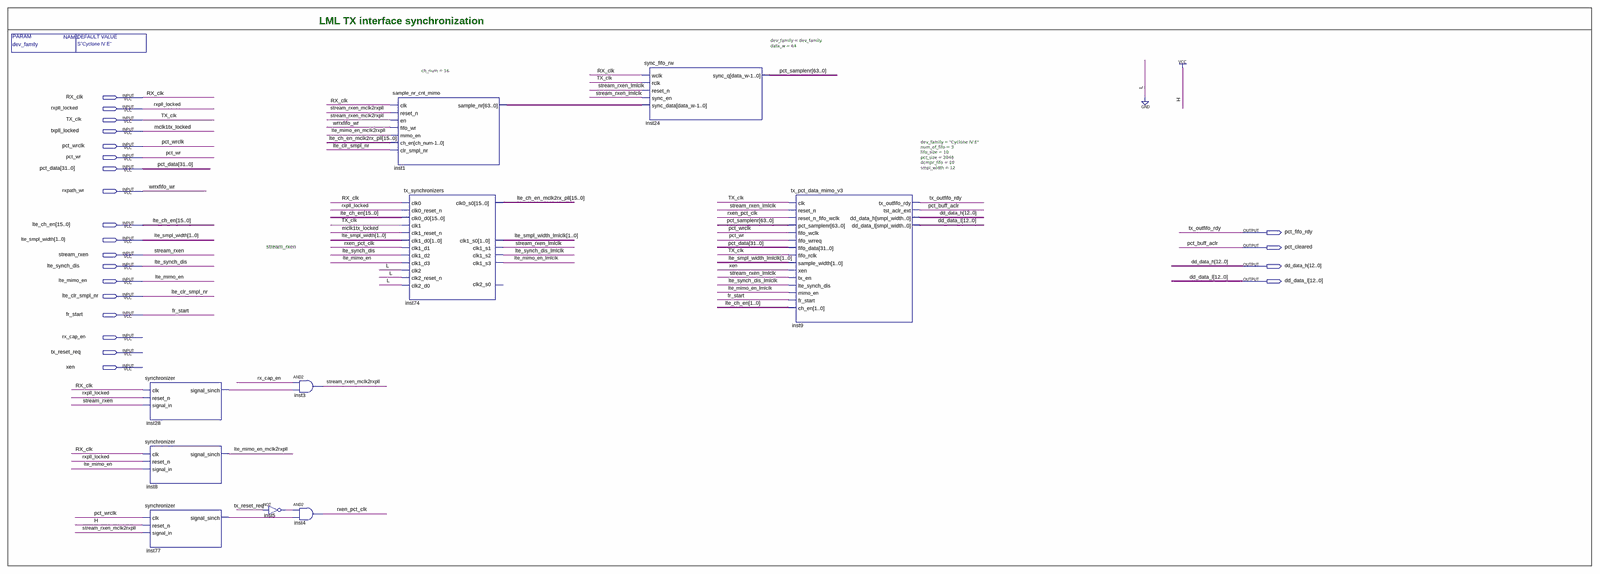
[diagram p0: schematic sheet, whole]
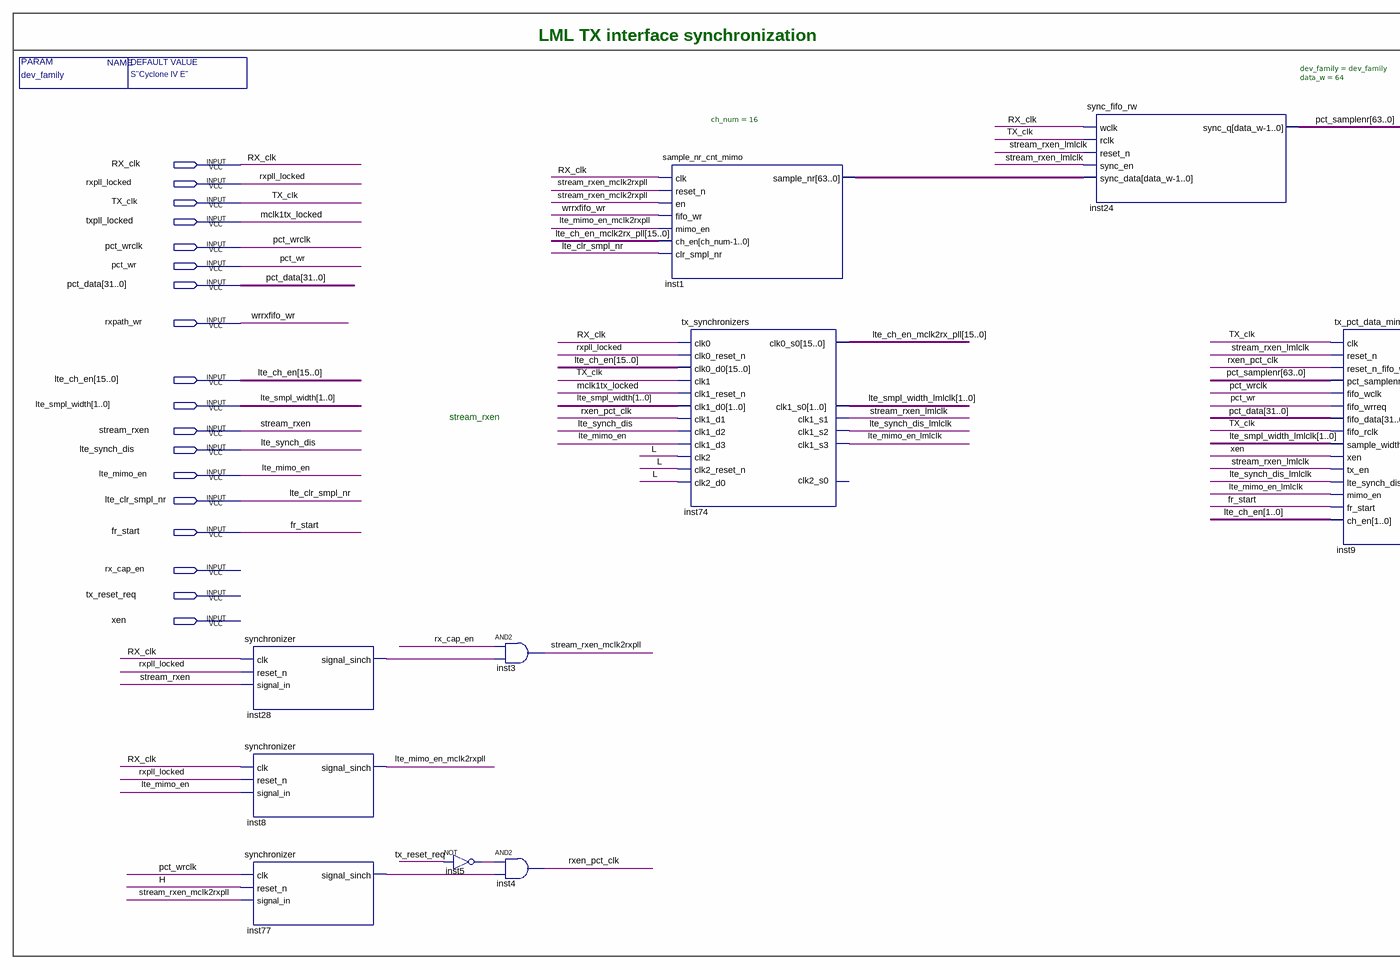
[diagram p1: schematic sheet, left part]
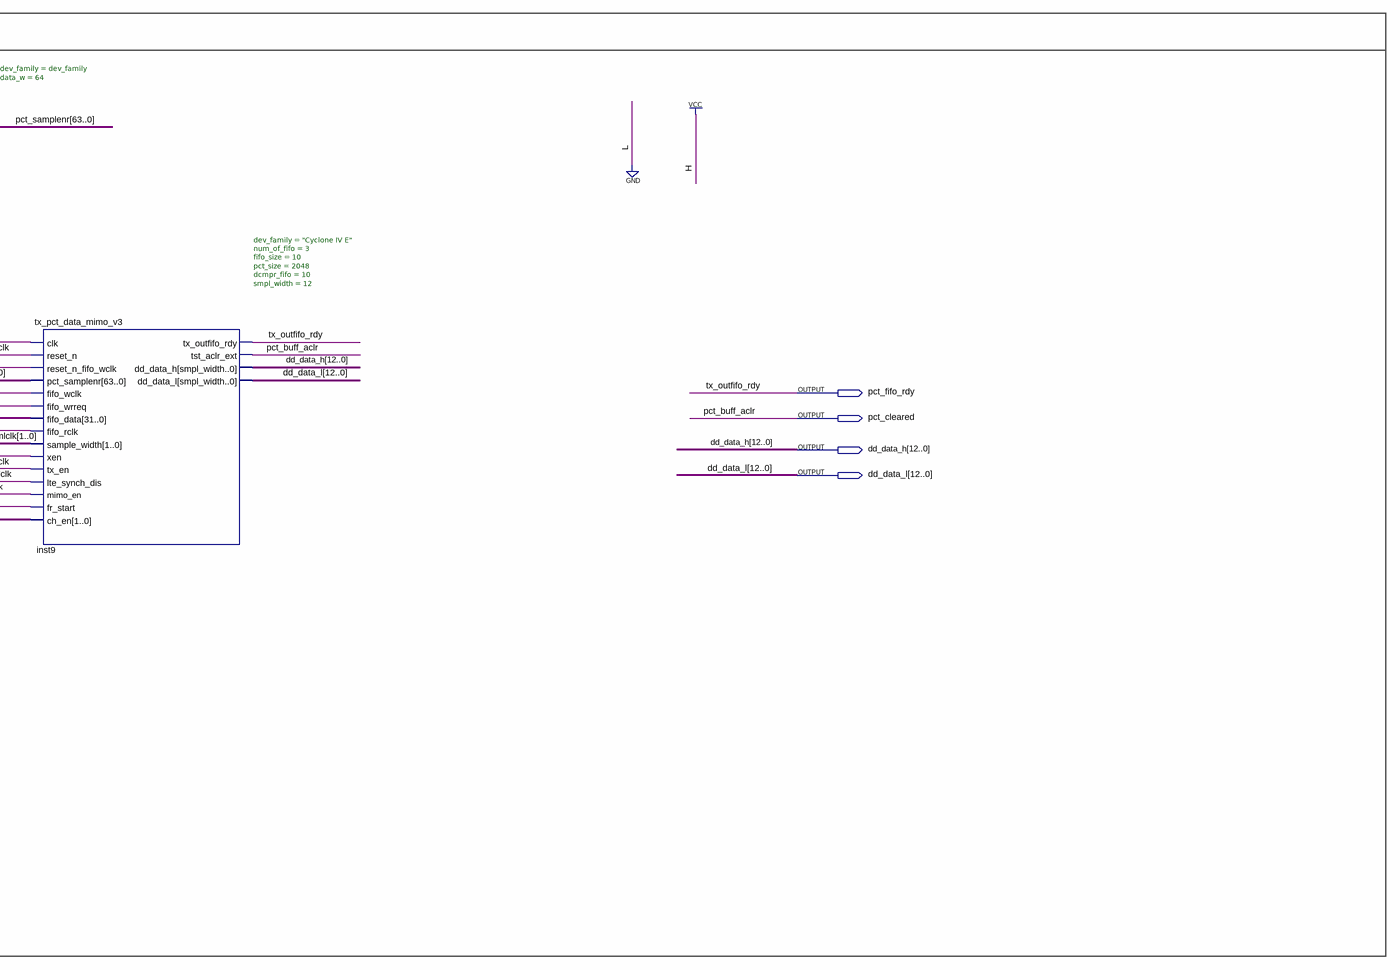
[diagram p2: schematic sheet, right part]
// Quartus schematic LTE_tx_path.bdf as structural Verilog: 10 symbols, 22 pins
module LTE_tx_path #(parameter dev_family = "S\"Cyclone IV E\"") (
  input  RX_clk,
  input  rxpll_locked,
  input  TX_clk,
  input  txpll_locked,
  input  pct_wrclk,
  input  pct_wr,
  input  [31:0] pct_data,
  input  rxpath_wr,
  input  [15:0] lte_ch_en,
  input  [1:0] lte_smpl_width,
  input  stream_rxen,
  input  lte_synch_dis,
  input  lte_mimo_en,
  input  lte_clr_smpl_nr,
  input  fr_start,
  input  rx_cap_en,
  input  tx_reset_req,
  input  xen,
  output pct_fifo_rdy,
  output pct_cleared,
  output [12:0] dd_data_h,
  output [12:0] dd_data_l
);

  wire inst5_out, inst28_signal_sinch, inst77_signal_sinch, lte_mimo_en_lmlclk, lte_mimo_en_mclk2rxpll,
       lte_synch_dis_lmlclk, rxen_pct_clk, stream_rxen_lmlclk, stream_rxen_mclk2rxpll;
  wire [1:0] lte_smpl_width_lmlclk;
  wire [15:0] lte_ch_en_mclk2rx_pll;
  wire [63:0] inst1_sample_nr, pct_samplenr;

  synchronizer inst28 (
    .clk(RX_clk), .reset_n(rxpll_locked), .signal_in(stream_rxen), .signal_sinch(inst28_signal_sinch));
  synchronizer inst8 (
    .clk(RX_clk), .reset_n(rxpll_locked), .signal_in(lte_mimo_en), .signal_sinch(lte_mimo_en_mclk2rxpll));
  synchronizer inst77 (
    .clk(pct_wrclk), .reset_n(1'b1), .signal_in(stream_rxen_mclk2rxpll), .signal_sinch(inst77_signal_sinch));
  not inst5 (inst5_out, tx_reset_req);
  and inst3 (stream_rxen_mclk2rxpll, rx_cap_en, inst28_signal_sinch);
  and inst4 (rxen_pct_clk, inst5_out, inst77_signal_sinch);
  sample_nr_cnt_mimo #(.ch_num(16)) inst1 (
    .clk(RX_clk), .reset_n(stream_rxen_mclk2rxpll), .en(stream_rxen_mclk2rxpll), .fifo_wr(rxpath_wr),
    .mimo_en(lte_mimo_en_mclk2rxpll), .ch_en(lte_ch_en_mclk2rx_pll), .clr_smpl_nr(lte_clr_smpl_nr),
    .sample_nr(inst1_sample_nr));
  tx_synchronizers inst74 (
    .clk0(RX_clk), .clk0_reset_n(rxpll_locked), .clk0_d0(lte_ch_en), .clk1(TX_clk),
    .clk1_reset_n(txpll_locked), .clk1_d0(lte_smpl_width), .clk1_d1(rxen_pct_clk), .clk1_d2(lte_synch_dis),
    .clk1_d3(lte_mimo_en), .clk2(1'b0), .clk2_reset_n(1'b0), .clk2_d0(1'b0), .clk0_s0(lte_ch_en_mclk2rx_pll),
    .clk1_s0(lte_smpl_width_lmlclk), .clk1_s1(stream_rxen_lmlclk), .clk1_s2(lte_synch_dis_lmlclk),
    .clk1_s3(lte_mimo_en_lmlclk));  // open: clk2_s0
  sync_fifo_rw #(.dev_family(dev_family), .data_w(64)) inst24 (
    .wclk(RX_clk), .rclk(TX_clk), .reset_n(stream_rxen_lmlclk), .sync_en(stream_rxen_lmlclk),
    .sync_data(inst1_sample_nr), .sync_q(pct_samplenr));
  tx_pct_data_mimo_v3 #(.dev_family("Cyclone IV E"), .num_of_fifo(3), .fifo_size(10), .pct_size(2048), .dcmpr_fifo(10), .smpl_width(12)) inst9 (
    .clk(TX_clk), .reset_n(stream_rxen_lmlclk), .reset_n_fifo_wclk(rxen_pct_clk),
    .pct_samplenr(pct_samplenr), .fifo_wclk(pct_wrclk), .fifo_wrreq(pct_wr), .fifo_data(pct_data),
    .fifo_rclk(TX_clk), .sample_width(lte_smpl_width_lmlclk), .xen(xen), .tx_en(stream_rxen_lmlclk),
    .lte_synch_dis(lte_synch_dis_lmlclk), .mimo_en(lte_mimo_en_lmlclk), .fr_start(fr_start),
    .ch_en(lte_ch_en[1:0]), .tx_outfifo_rdy(pct_fifo_rdy), .tst_aclr_ext(pct_cleared), .dd_data_h(dd_data_h),
    .dd_data_l(dd_data_l));

  // Other names for the same wires on the sheet: mclk1tx_locked = txpll_locked; pct_buff_aclr = pct_cleared;
  //   tx_outfifo_rdy = pct_fifo_rdy; wrrxfifo_wr = rxpath_wr

  // Notes on the sheet:
  //   LML TX interface synchronization
  //   stream_rxen
endmodule
